# Altium project FPGA_Peripheral_Board.PrjPcb (part 3 of 3)
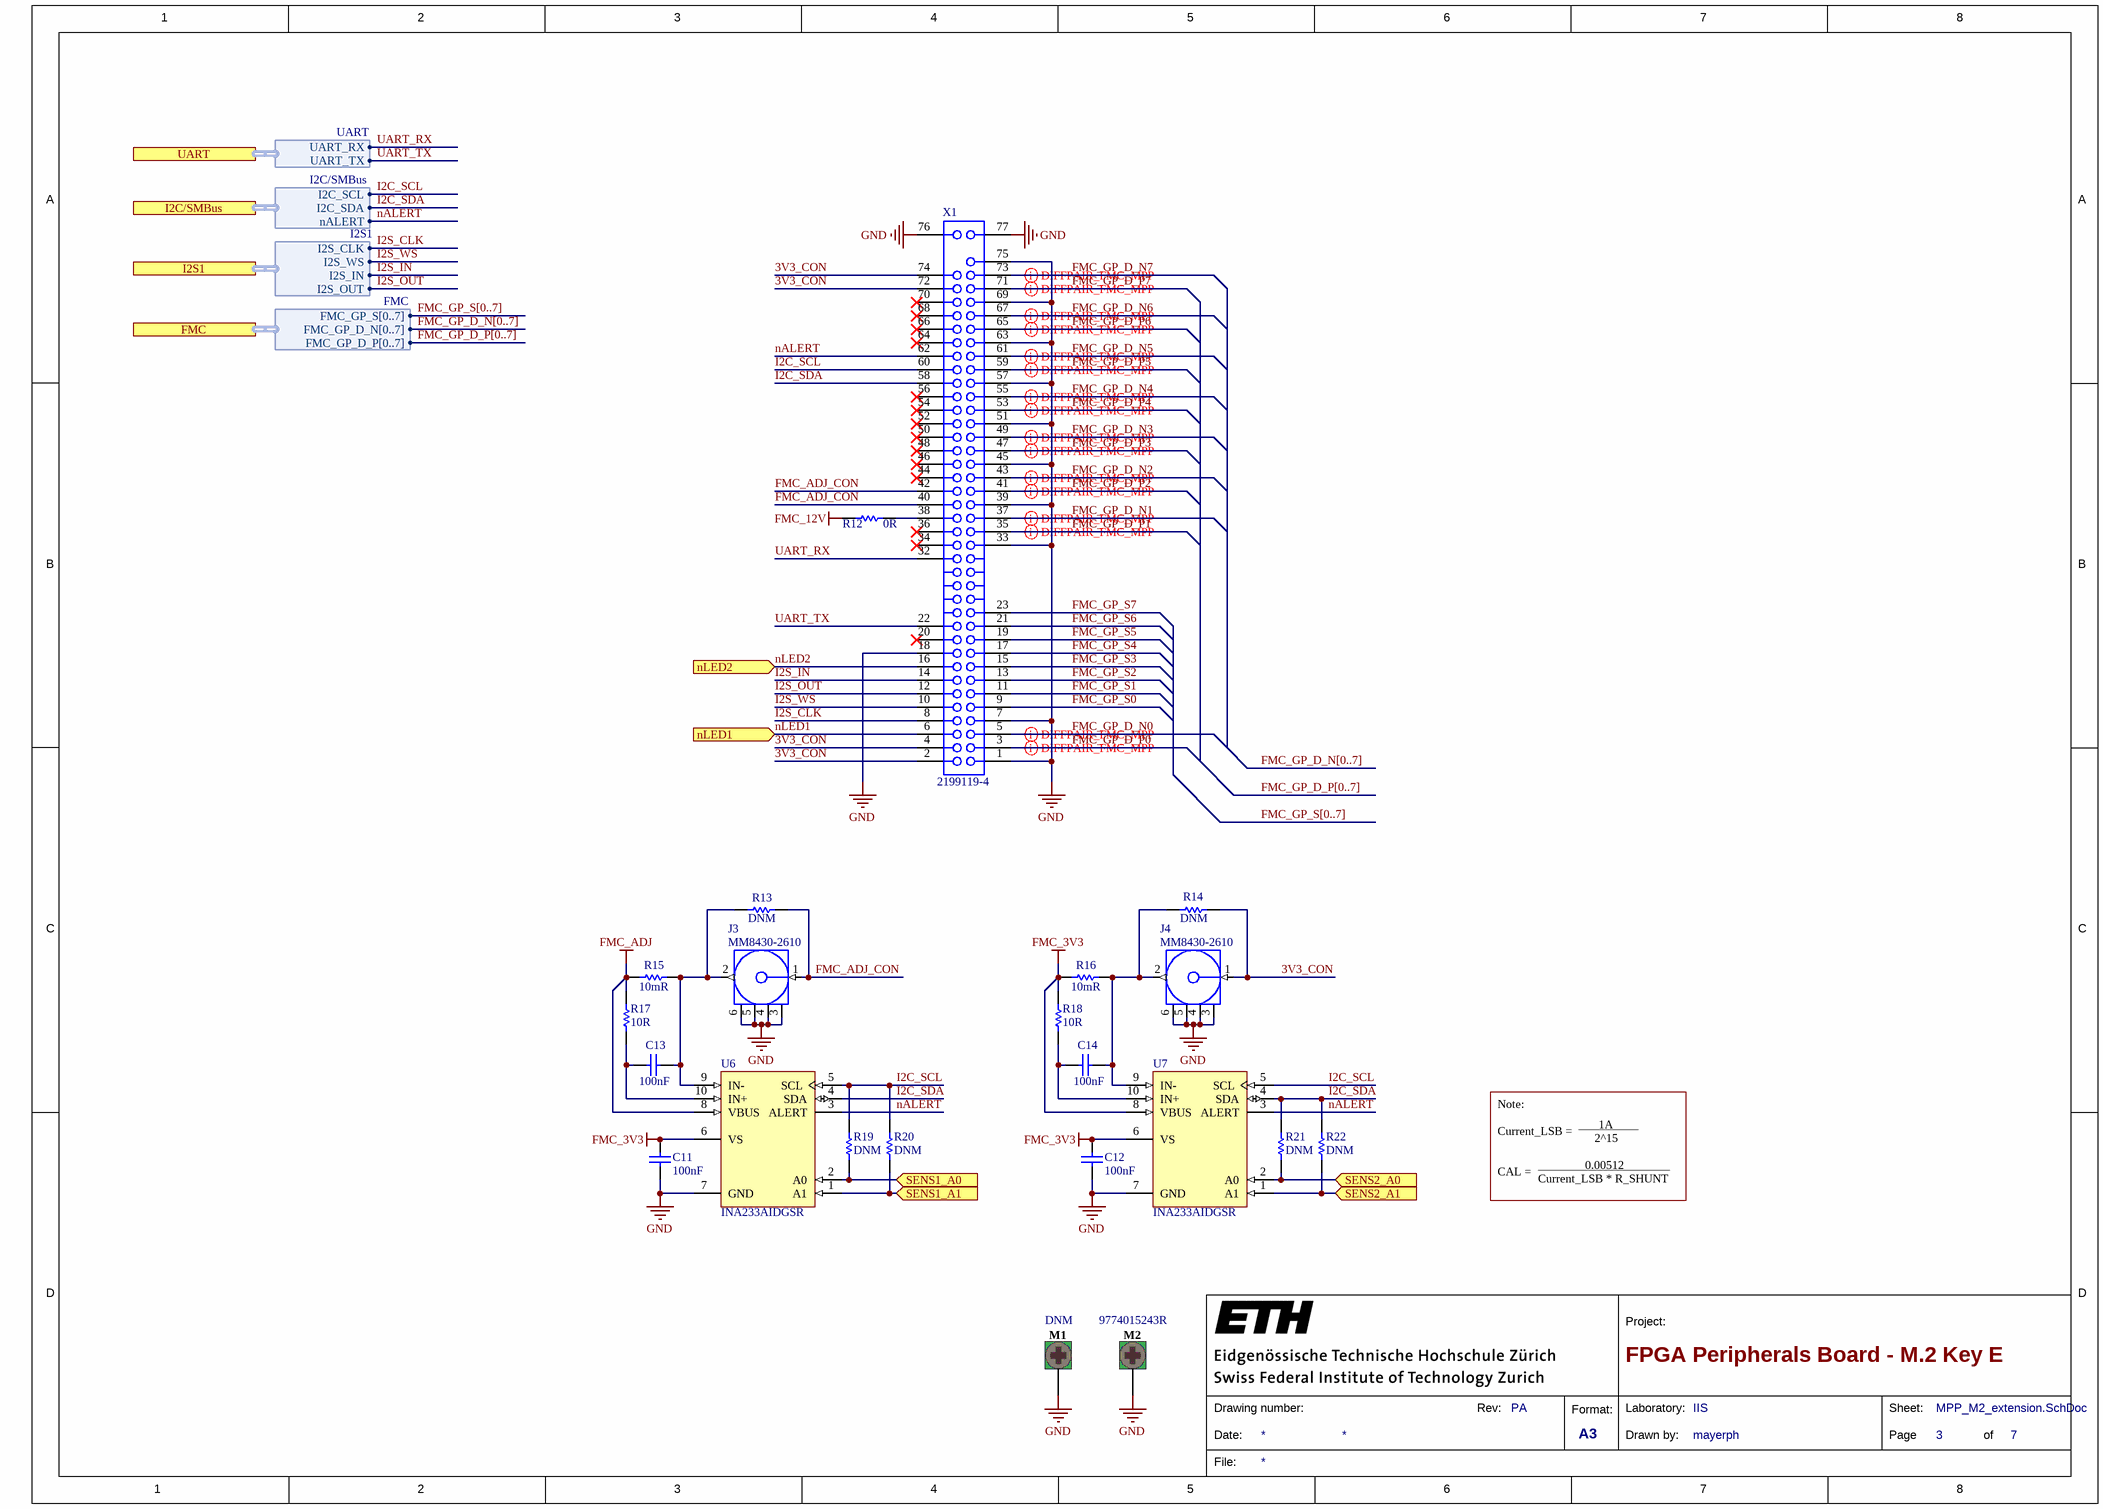
[diagram p7: MPP_M2_extension.SchDoc]

## Nets that join several sheets
FMC_3V3: FPGA_main (8 pins), QSPI_FLASH (R10.2), FMC (8 pins), CON1 (7 pins), CON2 (7 pins)
FMC_12V: FMC (J1.C35 J1.C37 P1.C35 P1.C37), CON1 (R12_CON1.2), CON2 (R12_CON2.2)
FMC_ADJ: FPGA_main (C19.2 C20.2 C21.2 C22.2), HyperBUS_RAM-FLASH (J2.2 R8.2), I2C_EEPROM (R9.2), QSPI_FLASH (R11.2), I2S_Mic (R1.2 R2.2), FMC (13 pins), CON1 (R15_CON1.1 R17_CON1.2 U6_CON1.8), CON2 (R15_CON2.1 R17_CON2.2 U6_CON2.8)
GND: FPGA_main (12 pins), HyperBUS_RAM-FLASH (12 pins), I2C_EEPROM (C8.1 U4.3 U4.4 U4.7), QSPI_FLASH (5 pins), I2S_Mic (7 pins), FMC (318 pins), CON1 (27 pins), CON2 (27 pins)
CON1_GP_D_N0: FMC (J1.G7 P1.G7), CON1 (X1_CON1.5)
CON1_GP_D_N1: FMC (J1.H8 P1.H8), CON1 (X1_CON1.37)
CON1_GP_D_N2: FMC (J1.G10 P1.G10), CON1 (X1_CON1.43)
CON1_GP_D_N3: FMC (J1.H11 P1.H11), CON1 (X1_CON1.49)
CON1_GP_D_N4: FMC (J1.G13 P1.G13), CON1 (X1_CON1.55)
CON1_GP_D_N5: FMC (J1.H14 P1.H14), CON1 (X1_CON1.61)
CON1_GP_D_N6: FMC (J1.G16 P1.G16), CON1 (X1_CON1.67)
CON1_GP_D_N7: FMC (J1.H17 P1.H17), CON1 (X1_CON1.73)
CON1_GP_D_P0: FMC (J1.G6 P1.G6), CON1 (X1_CON1.3)
CON1_GP_D_P1: FMC (J1.H7 P1.H7), CON1 (X1_CON1.35)
CON1_GP_D_P2: FMC (J1.G9 P1.G9), CON1 (X1_CON1.41)
CON1_GP_D_P3: FMC (J1.H10 P1.H10), CON1 (X1_CON1.47)
CON1_GP_D_P4: FMC (J1.G12 P1.G12), CON1 (X1_CON1.53)
CON1_GP_D_P5: FMC (J1.H13 P1.H13), CON1 (X1_CON1.59)
CON1_GP_D_P6: FMC (J1.G15 P1.G15), CON1 (X1_CON1.65)
CON1_GP_D_P7: FMC (J1.H16 P1.H16), CON1 (X1_CON1.71)
CON1_GP_S0: FMC (J1.G24 P1.G24), CON1 (X1_CON1.9)
CON1_GP_S1: FMC (J1.G25 P1.G25), CON1 (X1_CON1.11)
CON1_GP_S2: FMC (J1.H25 P1.H25), CON1 (X1_CON1.13)
CON1_GP_S3: FMC (J1.H26 P1.H26), CON1 (X1_CON1.15)
CON1_GP_S4: FMC (J1.G27 P1.G27), CON1 (X1_CON1.17)
CON1_GP_S5: FMC (J1.G28 P1.G28), CON1 (X1_CON1.19)
CON1_GP_S6: FMC (J1.H28 P1.H28), CON1 (X1_CON1.21)
CON1_GP_S7: FMC (J1.H29 P1.H29), CON1 (X1_CON1.23)
CON2_GP_D_N0: FMC (J1.J7 P1.J7), CON2 (X1_CON2.5)
CON2_GP_D_N1: FMC (J1.K8 P1.K8), CON2 (X1_CON2.37)
CON2_GP_D_N2: FMC (J1.J10 P1.J10), CON2 (X1_CON2.43)
CON2_GP_D_N3: FMC (J1.K11 P1.K11), CON2 (X1_CON2.49)
CON2_GP_D_N4: FMC (J1.J13 P1.J13), CON2 (X1_CON2.55)
CON2_GP_D_N5: FMC (J1.K14 P1.K14), CON2 (X1_CON2.61)
CON2_GP_D_N6: FMC (J1.J16 P1.J16), CON2 (X1_CON2.67)
CON2_GP_D_N7: FMC (J1.K17 P1.K17), CON2 (X1_CON2.73)
CON2_GP_D_P0: FMC (J1.J6 P1.J6), CON2 (X1_CON2.3)
CON2_GP_D_P1: FMC (J1.K7 P1.K7), CON2 (X1_CON2.35)
CON2_GP_D_P2: FMC (J1.J9 P1.J9), CON2 (X1_CON2.41)
CON2_GP_D_P3: FMC (J1.K10 P1.K10), CON2 (X1_CON2.47)
CON2_GP_D_P4: FMC (J1.J12 P1.J12), CON2 (X1_CON2.53)
CON2_GP_D_P5: FMC (J1.K13 P1.K13), CON2 (X1_CON2.59)
CON2_GP_D_P6: FMC (J1.J15 P1.J15), CON2 (X1_CON2.65)
CON2_GP_D_P7: FMC (J1.K16 P1.K16), CON2 (X1_CON2.71)
CON2_GP_S0: FMC (J1.G18 P1.G18), CON2 (X1_CON2.9)
CON2_GP_S1: FMC (J1.G19 P1.G19), CON2 (X1_CON2.11)
CON2_GP_S2: FMC (J1.H19 P1.H19), CON2 (X1_CON2.13)
CON2_GP_S3: FMC (J1.H20 P1.H20), CON2 (X1_CON2.15)
CON2_GP_S4: FMC (J1.G21 P1.G21), CON2 (X1_CON2.17)
CON2_GP_S5: FMC (J1.G22 P1.G22), CON2 (X1_CON2.19)
CON2_GP_S6: FMC (J1.H22 P1.H22), CON2 (X1_CON2.21)
CON2_GP_S7: FMC (J1.H23 P1.H23), CON2 (X1_CON2.23)
CON_I2S_CLK: FMC (J1.G33 P1.G33), CON1 (X1_CON1.8), CON2 (X1_CON2.8)
CON_I2S_IN: FMC (J1.H34 P1.H34), CON1 (X1_CON1.14), CON2 (X1_CON2.14)
CON_I2S_OUT: FMC (J1.H35 P1.H35), CON1 (X1_CON1.12), CON2 (X1_CON2.12)
CON_I2S_WS: FMC (J1.G34 P1.G34), CON1 (X1_CON1.10), CON2 (X1_CON2.10)
HYPER_CK_N: HyperBUS_RAM-FLASH (R32.1 U3.B1), FMC (J1.D9 P1.D9)
HYPER_CK_P: HyperBUS_RAM-FLASH (R32.2 U3.B2), FMC (J1.D8 P1.D8)
HYPER_CSN0: HyperBUS_RAM-FLASH (R39.1 U3.C2), FMC (J1.D18 P1.D18)
HYPER_CSN1: HyperBUS_RAM-FLASH (R40.1 U3.A3), FMC (J1.D17 P1.D17)
HYPER_D0: HyperBUS_RAM-FLASH (R31.1), FMC (J1.C14 P1.C14)
HYPER_D1: HyperBUS_RAM-FLASH (R33.1), FMC (J1.C10 P1.C10)
HYPER_D2: HyperBUS_RAM-FLASH (R34.1), FMC (J1.D15 P1.D15)
HYPER_D3: HyperBUS_RAM-FLASH (R35.1), FMC (J1.C15 P1.C15)
HYPER_D4: HyperBUS_RAM-FLASH (R36.1), FMC (J1.D14 P1.D14)
HYPER_D5: HyperBUS_RAM-FLASH (R37.1), FMC (J1.D12 P1.D12)
HYPER_D6: HyperBUS_RAM-FLASH (R38.1), FMC (J1.D11 P1.D11)
HYPER_D7: HyperBUS_RAM-FLASH (R41.1), FMC (J1.C11 P1.C11)
HYPER_RWDS: HyperBUS_RAM-FLASH (R48.1), FMC (J1.C18 P1.C18)
I2C/SMBus_nALERT: FMC (J1.C19 P1.C19 R5.1), CON1 (U6_CON1.3 U7_CON1.3 X1_CON1.62), CON2 (U6_CON2.3 U7_CON2.3 X1_CON2.62)
I2C/SMBus_SCL: FMC (J1.G30 P1.G30 R7.1), CON1 (5 pins), CON2 (5 pins)
I2C/SMBus_SDA: FMC (J1.G31 P1.G31 R6.1), CON1 (5 pins), CON2 (5 pins)
I2C_SCL: I2C_EEPROM (U4.6), FMC (J1.D26 P1.D26 R4.1)
I2C_SDA: I2C_EEPROM (U4.5), FMC (J1.D27 P1.D27 R3.1)
I2S_CLK: I2S_Mic (U1.3 U2.3), FMC (J1.C26 P1.C26)
I2S_OUT: I2S_Mic (U1.4 U2.4), FMC (J1.C27 P1.C27)
NetR19_CON1_2: FPGA_main (R23.2), CON1 (R19_CON1.2 U6_CON1.2)
NetR19_CON2_2: FPGA_main (R27.2), CON2 (R19_CON2.2 U6_CON2.2)
NetR20_CON1_2: FPGA_main (R24.2), CON1 (R20_CON1.2 U6_CON1.1)
NetR20_CON2_2: FPGA_main (R28.2), CON2 (R20_CON2.2 U6_CON2.1)
NetR21_CON1_2: FPGA_main (R25.2), CON1 (R21_CON1.2 U7_CON1.2)
NetR21_CON2_2: FPGA_main (R29.2), CON2 (R21_CON2.2 U7_CON2.2)
NetR22_CON1_2: FPGA_main (R26.2), CON1 (R22_CON1.2 U7_CON1.1)
NetR22_CON2_2: FPGA_main (R30.2), CON2 (R22_CON2.2 U7_CON2.1)
nLED1: FMC (J1.G37 P1.G37), CON1 (X1_CON1.6)
nLED1: FMC (J1.H38 P1.H38), CON2 (X1_CON2.6)
nLED2: FMC (J1.G36 P1.G36), CON1 (X1_CON1.16)
nLED2: FMC (J1.H37 P1.H37), CON2 (X1_CON2.16)
QSPI_IO0: QSPI_FLASH (R44.2), FMC (J1.C23 P1.C23)
QSPI_IO1: QSPI_FLASH (R45.2), FMC (J1.D21 P1.D21)
QSPI_IO2: QSPI_FLASH (R46.2), FMC (J1.D20 P1.D20)
QSPI_IO3: QSPI_FLASH (R47.2), FMC (J1.D24 P1.D24)
QSPI_nCS: QSPI_FLASH (R42.1 U5.7), FMC (J1.C22 P1.C22)
QSPI_SCK: QSPI_FLASH (R43.1 U5.16), FMC (J1.D23 P1.D23)
UART_RX: FMC (J1.H31 P1.H31), CON1 (X1_CON1.32), CON2 (X1_CON2.32)
UART_TX: FMC (J1.H32 P1.H32), CON1 (X1_CON1.22), CON2 (X1_CON2.22)

## Assembly variants
main: not fitted M1_CON1 M1_CON2 R8 R13_CON1 R13_CON2 R14_CON1 R14_CON2 R19_CON1 R19_CON2 R20_CON1 R20_CON2 R21_CON1 R21_CON2 R22_CON1 R22_CON2